# Altium schematic sheet Superbot_motor_boost_mk2.SchDoc
size A4
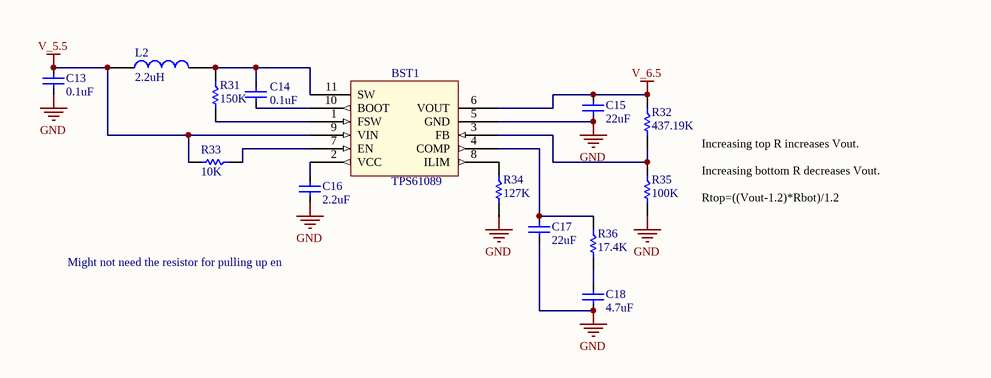
[diagram p0: Superbot_motor_boost_mk2.SchDoc]

## Parts
BST1  TPS61089  [VQFN_RNR0011A_1mm]
C13  0.1uF  [CAP0603R]
C14  0.1uF  [CAP0603R]
C15  22uF  [CAP0805R]
C16  2.2uF  [CAP0603R]
C17  22uF  [CAP0805R]
C18  4.7uF  [CAP0603R]
L2  2.2uH  [744031004]
R31  150K  [RES0603R]
R32  437.19K  [RES0603R]
R33  10K  [RES0603R]
R34  127K  [RES0603R]
R35  100K  [RES0603R]
R36  17.4K  [RES0603R]

## Nets
GND: BST1.5(GND) C13.2 C15.2 C16.2 C17.2 C18.2 R34.2 R35.2
V_5.5: BST1.9(VIN) C13.1 L2.1 R33.2
V_6.5: BST1.6(VOUT) C15.1 R32.1
NetBST1_1: BST1.1(FSW) R31.2
NetBST1_2: BST1.2(VCC) C16.1
NetBST1_3: BST1.3(FB) R32.2 R35.1
NetBST1_4: BST1.4(COMP) C17.1 R36.1
NetBST1_7: BST1.7(EN) R33.1
NetBST1_8: BST1.8(ILIM) R34.1
NetBST1_10: BST1.10(BOOT) C14.2
NetBST1_11: BST1.11(SW) C14.1 L2.2 R31.1
NetC18_1: C18.1 R36.2

## Notes on the sheet
- Might not need the resistor for pulling up en
- Increasing top R increases Vout.
  Increasing bottom R decreases Vout.
  Rtop=((Vout-1.2)*Rbot)/1.2

## Library data of the parts
BST1 = TPS61089: Boost Switching Regulator IC Positive Adjustable 4.5V 1 Output 7A 11-VFQFN; Manufacturer: Texas Instruments; Manufacturer Part Num: TPS61089RNRT; Class I: PMIC; Supplier 1: Digikey; Supplier Part Number 1: 296-46242-1-ND
C13-C18 = C: Capacitor; Manufacturer: Microchip Technology; Manufacturer Part Num: MIC5378YC5-TR; Class I: Passive; Revision: July-2002: Re-released for DXP Platform.; Supplier 1: Digikey; Supplier Part Number 1: *; Supplier Part Number 1: 1611-MIC5378YC5-CT-ND
  C13 C14: Value: 0.1uF
  C15 C17: Value: 22uF
  C16: Value: 2.2uF
  C18: Value: 4.7uF
L2 = L: Inductor; Value: 1uH; Supplier 1: Digikey; Supplier Part Number 1: *
R31-R36 = R: Resistor; Supplier 1: Digikey; Supplier Part Number 1: *
  R31: Value: 150K
  R32: Value: 437.19K
  R33: Value: 10K
  R34: Value: 127K
  R35: Value: 100K
  R36: Value: 17.4K